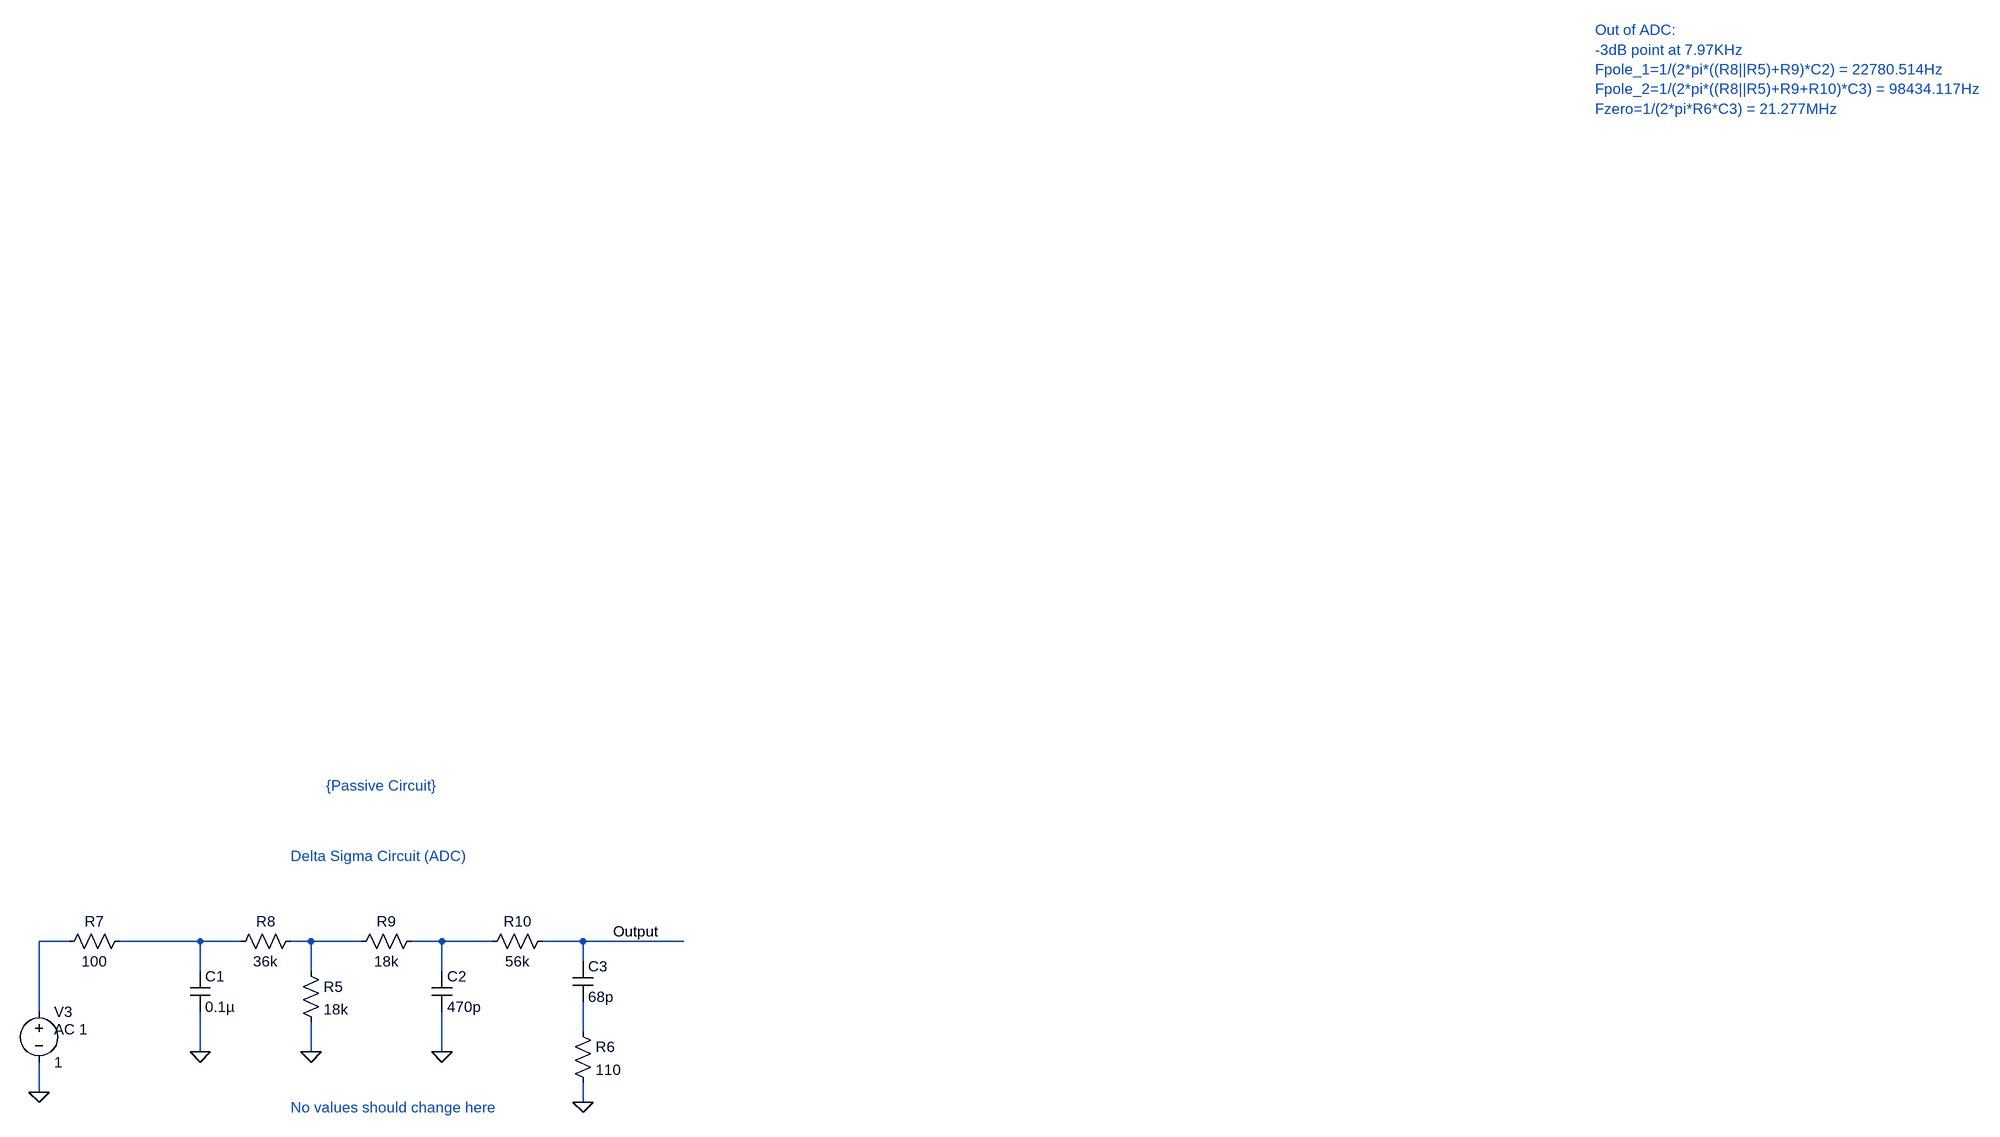
[diagram p0: schematic Passive_Circuit_ADC_Only.asc]
Passive_Circuit_ADC_Only.asc, the LTspice schematic file:
Version 4
SHEET 1 1812 680
WIRE -1536 -304 -1584 -304
WIRE -1328 -304 -1456 -304
WIRE -1264 -304 -1328 -304
WIRE -1152 -304 -1184 -304
WIRE -1072 -304 -1152 -304
WIRE -944 -304 -992 -304
WIRE -864 -304 -944 -304
WIRE -720 -304 -784 -304
WIRE -560 -304 -720 -304
WIRE -720 -272 -720 -304
WIRE -1328 -256 -1328 -304
WIRE -1152 -256 -1152 -304
WIRE -944 -256 -944 -304
WIRE -1584 -192 -1584 -304
WIRE -720 -160 -720 -208
WIRE -1328 -128 -1328 -192
WIRE -1152 -128 -1152 -176
WIRE -944 -128 -944 -192
WIRE -1584 -64 -1584 -112
WIRE -720 -48 -720 -80
FLAG -1584 -64 0
FLAG -1328 -128 0
FLAG -1152 -128 0
FLAG -944 -128 0
FLAG -720 -48 0
SYMBOL voltage -1584 -208 R0
WINDOW 123 24 44 Left 2
WINDOW 39 0 0 Left 0
SYMATTR Value2 AC 1
SYMATTR InstName V3
SYMATTR Value 1
SYMBOL res -1168 -272 R0
SYMATTR InstName R5
SYMATTR Value 18k
SYMBOL res -736 -176 R0
SYMATTR InstName R6
SYMATTR Value 110
SYMBOL res -1440 -320 R90
WINDOW 0 0 56 VBottom 2
WINDOW 3 32 56 VTop 2
SYMATTR InstName R7
SYMATTR Value 100
SYMBOL res -1168 -320 R90
WINDOW 0 0 56 VBottom 2
WINDOW 3 32 56 VTop 2
SYMATTR InstName R8
SYMATTR Value 36k
SYMBOL res -976 -320 R90
WINDOW 0 0 56 VBottom 2
WINDOW 3 32 56 VTop 2
SYMATTR InstName R9
SYMATTR Value 18k
SYMBOL res -768 -320 R90
WINDOW 0 0 56 VBottom 2
WINDOW 3 32 56 VTop 2
SYMATTR InstName R10
SYMATTR Value 56k
SYMBOL cap -1344 -256 R0
SYMATTR InstName C1
SYMATTR Value 0.1µ
SYMBOL cap -960 -256 R0
SYMATTR InstName C2
SYMATTR Value 470p
SYMBOL cap -736 -272 R0
SYMATTR InstName C3
SYMATTR Value 68p
TEXT 888 -1752 Left 2 ;Out of ADC:\n-3dB point at 7.97KHz\nFpole_1=1/(2*pi*((R8||R5)+R9)*C2) = 22780.514Hz\nFpole_2=1/(2*pi*((R8||R5)+R9+R10)*C3) = 98434.117Hz\nFzero=1/(2*pi*R6*C3) = 21.277MHz
TEXT -1128 -552 Left 2 ;{Passive Circuit}
TEXT -1184 -440 Left 2 ;Delta Sigma Circuit (ADC)
TEXT -1184 -40 Left 2 ;No values should change here
TEXT -672 -320 Left 2 !Output

The netlist it stands for:
* Passive_Circuit_ADC_Only.asc
V3 N001 0 1 AC 1
R5 N003 0 18k
R6 N006 0 110
R7 N002 N001 100
R8 N003 N002 36k
R9 N004 N003 18k
R10 N005 N004 56k
C1 N002 0 0.1µ
C2 N004 0 470p
C3 N005 N006 68p
* Out of ADC:
* -3dB point at 7.97KHz
* Fpole_1=1/(2*pi*((R8||R5)+R9)*C2) = 22780.514Hz
* Fpole_2=1/(2*pi*((R8||R5)+R9+R10)*C3) = 98434.117Hz
* Fzero=1/(2*pi*R6*C3) = 21.277MHz
* {Passive Circuit}
* Delta Sigma Circuit (ADC)
* No values should change here
Output
.backanno
.end